# Altium schematic sheet PcbAssignment.SchDoc
size A4
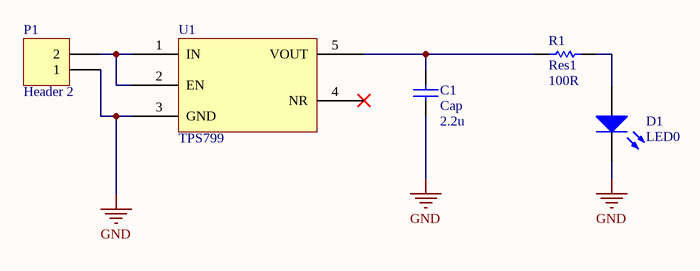
[diagram p0: PcbAssignment.SchDoc]

## Parts
C1  Cap  value 2.2u  [RAD-0.3]
D1  LED0  [LED-0]
P1  Header 2  [HDR1X2]
R1  Res1  value 100R  [AXIAL-0.3]
U1  TPS799  [SOT-5]

## Nets
GND: C1.1 D1.2(K) P1.1 U1.3(GND)
NetC1_2: C1.2 R1.2 U1.5(VOUT)
NetD1_1: D1.1(A) R1.1
NetP1_2: P1.2 U1.1(IN) U1.2(EN)

Not connected (* = marked no-connect by the designer): U1 4(NR)*

## Library data of the parts
C1 = Cap: Capacitor; Published: 8-Jun-2000; LatestRevisionDate: 17-Jul-2002; LatestRevisionNote: Re-released for DXP Platform.; PackageReference: RAD-0.3; Publisher: Altium Limited; PackageDescription: Radial Cap, Thru-Hole; 2 Leads; 0.3 in Pin Spacing
D1 = LED0: Typical INFRARED GaAs LED; Published: 8-Jun-2000; LatestRevisionDate: 08-Jul-2005; LatestRevisionNote: Mech Layer 1 removed.; PackageReference: LED-0; Publisher: Altium Limited; PackageDescription: LED; 2 Leads
P1 = Header 2: Header, 2-Pin; LatestRevisionDate: 17-Jul-2002; LatestRevisionNote: Re-released for DXP Platform.; Publisher: Altium Limited
R1 = Res1: Resistor; Published: 8-Jun-2000; LatestRevisionDate: 17-Jul-2002; LatestRevisionNote: Re-released for DXP Platform.; PackageReference: AXIAL-0.3; Publisher: Altium Limited; PackageDescription: Axial Device, Thru-Hole; 2 Leads; 0.3 in Pin Spacing